# EAGLE design syringe board 1.6 (EAGLE 7.7.0)
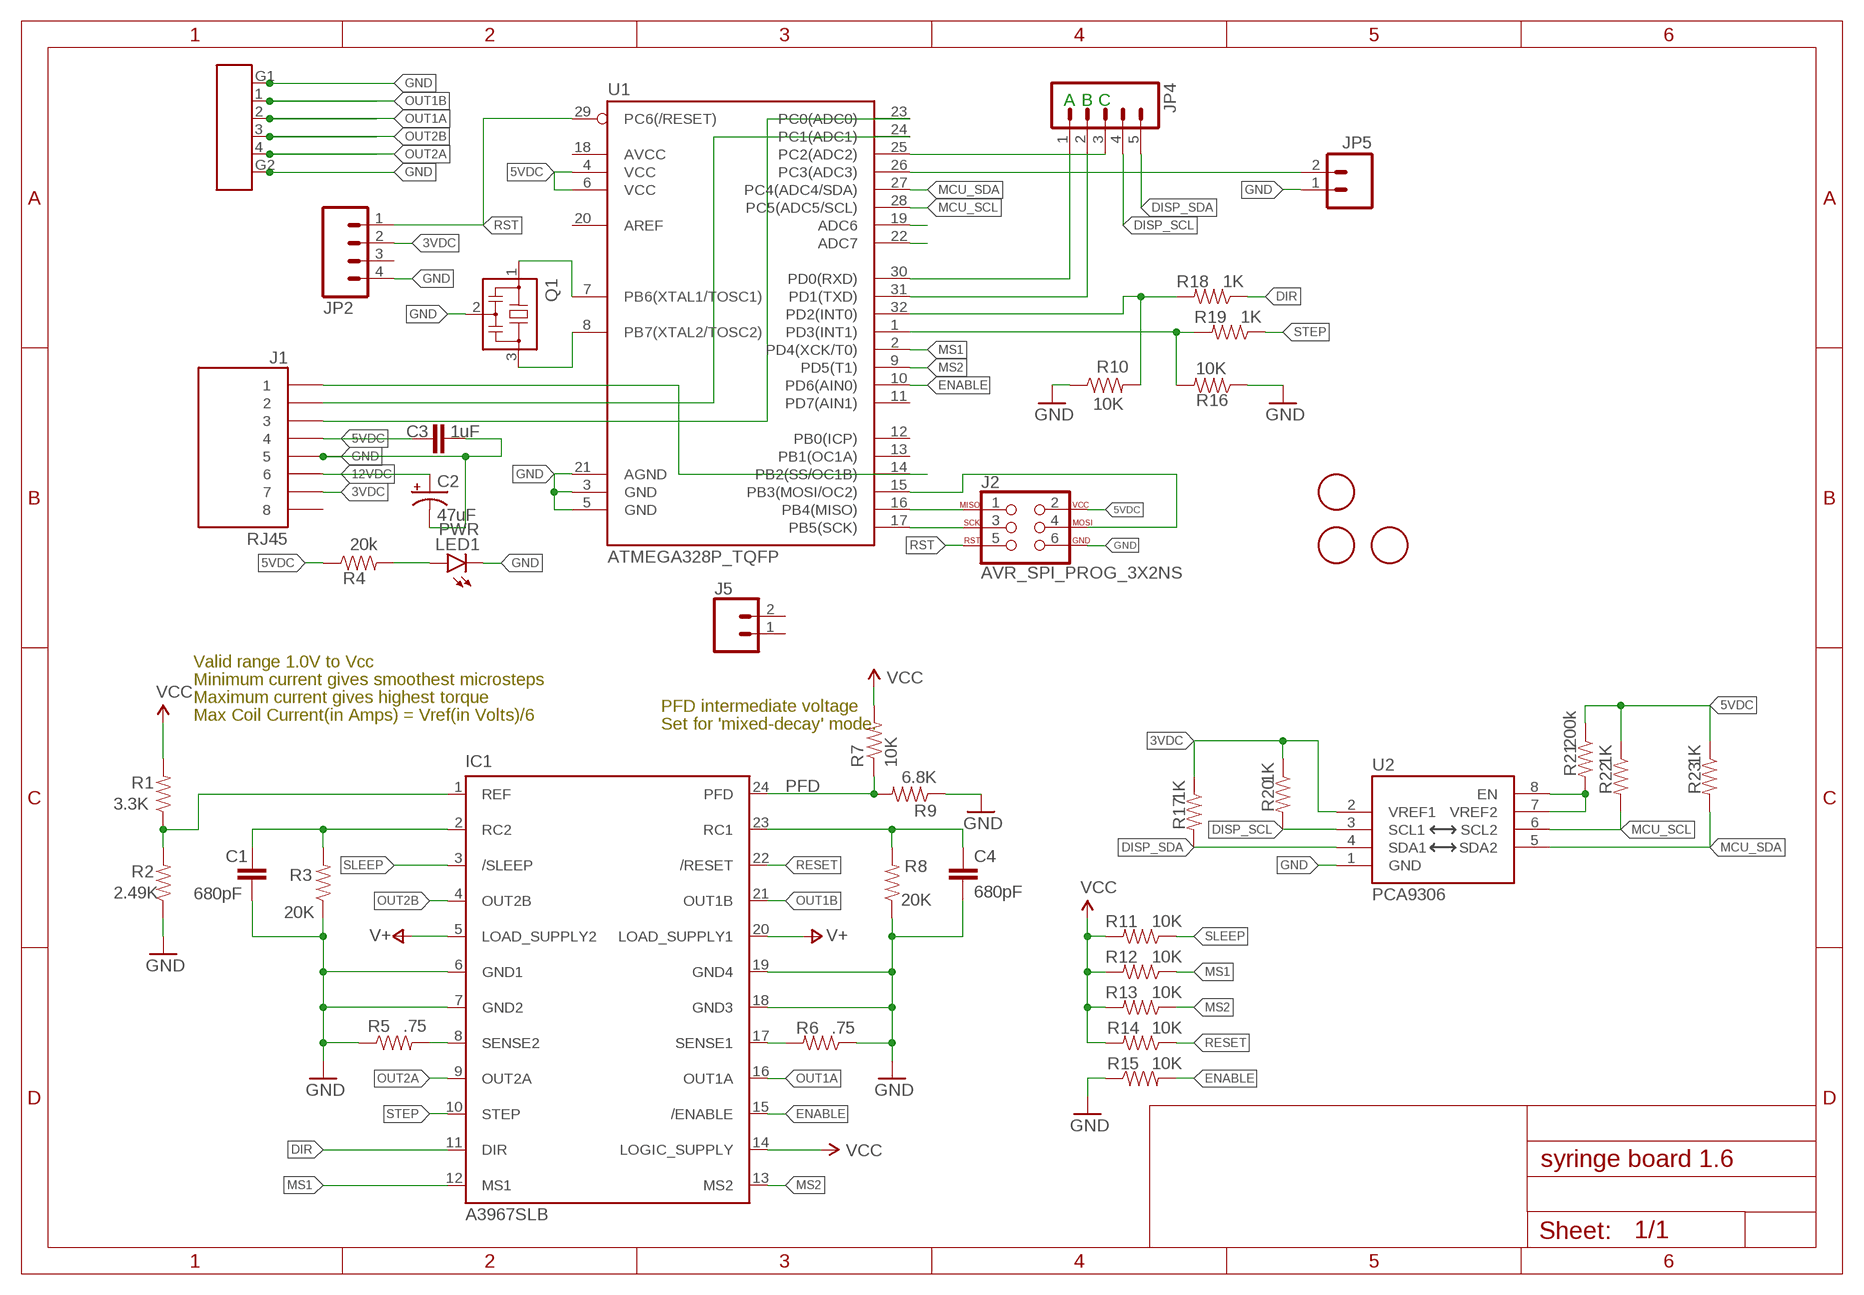
[diagram p0: schematic, sheet 1]

## Parts
C1  680pF  CAP0603-CAP  [0603-CAP]
C2  47uF  CPOL-USD  [PANASONIC_D]
C3  1uF  CAP0603-CAP  [0603-CAP]
C4  680pF  CAP0603-CAP  [0603-CAP]
IC1  A3967SLB  [SO24W]
J1  RJ45  [RJ45-8]
J2  AVR_SPI_PROG_3X2NS  [2X3-NS]
J5  CONN_021X02_NO_SILK  [1X02_NO_SILK]
JP2  M04NO_SILK_ALL_ROUND  [1X04_NO_SILK_ALL_ROUND]
JP4  M05NO_SILK  [1X05_NO_SILK]
JP5  M021X02_NO_SILK  [1X02_NO_SILK@1]
LED1  PWR  LED0603  [LED-0603]
Q1  RESONATOR_CSTCE_V  [CSTCE_V]
R1  3.3K  RESISTOR0603  [0603-RES]
R2  2.49K  RESISTOR0603  [0603-RES]
R3  20K  RESISTOR0603  [0603-RES]
R4  20k  RESISTOR0603  [0603-RES]
R5  .75  RESISTOR0805-RES  [0805]
R6  .75  RESISTOR0805-RES  [0805]
R7  10K  RESISTOR0603  [0603-RES]
R8  20K  RESISTOR0603  [0603-RES]
R9  6.8K  RESISTOR0603  [0603-RES]
R10  10K  RESISTOR0603  [0603-RES]
R11  10K  RESISTOR0603  [0603-RES]
R12  10K  RESISTOR0603  [0603-RES]
R13  10K  RESISTOR0603  [0603-RES]
R14  10K  RESISTOR0603  [0603-RES]
R15  10K  RESISTOR0603  [0603-RES]
R16  10K  RESISTOR0603  [0603-RES]
R17  1K  RESISTOR0603  [0603-RES]
R18  1K  RESISTOR0603  [0603-RES]
R19  1K  RESISTOR0603  [0603-RES]
R20  1K  RESISTOR0603  [0603-RES]
R21  200k  RESISTOR0603  [0603-RES]
R22  1K  RESISTOR0603  [0603-RES]
R23  1K  RESISTOR0603  [0603-RES]
U1  ATMEGA328P_TQFP  [TQFP32-08]
U2  PCA9306  [PSOP-8]
U$1  FIDUCIAL  [FIDUCIAL_1MM]
U$2  FIDUCIAL  [FIDUCIAL_1MM]
U$3  FIDUCIAL  [FIDUCIAL_1MM]
U$5  OMRON_4PIN  [OMRON_4PIN]

## Nets
3VDC: J1.7 JP2.2 R17.1 R20.1 U2.2(VREF1)
5VDC: C3.1 IC1.14(LOGIC_SUPPLY) J1.4 J2.2 R1.2 R4.1 R7.2 R11.2 R12.2 R13.2 R14.2 R21.1 R22.1 R23.1 U1.4(VCC) U1.6(VCC) ; supply symbol labelled VCC
12VDC: C2.+ IC1.5(LOAD_SUPPLY2) IC1.20(LOAD_SUPPLY1) J1.6 ; supply symbol labelled V+
DIR: IC1.11(DIR) R18.1
DIR_IN: R10.2 R18.2 U1.32(PD2(INT0))
DISP_SCL: JP4.4 R20.2 U2.3(SCL1)
DISP_SDA: JP4.5 R17.2 U2.4(SDA1)
ENABLE: IC1.15(/ENABLE) R15.2 U1.10(PD6(AIN0))
GND: C1.2 C2.- C3.2 C4.2 IC1.6(GND1) IC1.7(GND2) IC1.18(GND3) IC1.19(GND4) J1.5 J2.6 JP2.4 JP5.1 LED1.C Q1.2 R2.1 R3.1 R5.1 R6.1 R8.1 R9.1 R10.1 R15.1 R16.1 U1.3(GND) U1.5(GND) U1.21(AGND) U2.1(GND) U$5.G1(GND1) U$5.G2(GND2)
MCU_SCL: R22.2 U1.28(PC5(ADC5/SCL)) U2.6(SCL2)
MCU_SDA: R23.2 U1.27(PC4(ADC4/SDA)) U2.5(SDA2)
MS1: IC1.12(MS1) R12.1 U1.2(PD4(XCK/T0))
MS2: IC1.13(MS2) R13.1 U1.9(PD5(T1))
N$1: IC1.8(SENSE2) R5.2
N$2: Q1.1 U1.7(PB6(XTAL1/TOSC1))
N$3: IC1.17(SENSE1) R6.2
N$4: Q1.3 U1.8(PB7(XTAL2/TOSC2))
N$5: C1.1 IC1.2(RC2) R3.2
N$6: R21.2 U2.7(VREF2) U2.8(EN)
N$7: C4.1 IC1.23(RC1) R8.2
N$8: LED1.A R4.2
N$9: J2.1 U1.16(PB4(MISO))
N$10: J2.3 U1.17(PB5(SCK))
N$11: J2.4 U1.15(PB3(MOSI/OC2))
N$12: J1.3 U1.23(PC0(ADC0))
N$14: U1.22(ADC7)
N$15: JP4.1 U1.30(PD0(RXD))
N$16: JP4.2 U1.31(PD1(TXD))
N$17: JP4.3 U1.25(PC2(ADC2))
N$18: U1.19(ADC6)
N$19: JP5.2 U1.26(PC3(ADC3))
N$20: J1.2 U1.24(PC1(ADC1))
N$21: J1.1 U1.14(PB2(SS/OC1B))
OUT1A: IC1.16(OUT1A) U$5.2
OUT1B: IC1.21(OUT1B) U$5.1
OUT2A: IC1.9(OUT2A) U$5.4
OUT2B: IC1.4(OUT2B) U$5.3
PFD: IC1.24(PFD) R7.1 R9.2
RESET: IC1.22(/RESET) R14.1
RST: J2.5 JP2.1 U1.29(PC6(/RESET))
SLEEP: IC1.3(/SLEEP) R11.1
STEP: IC1.10(STEP) R19.1
STEP_IN: R16.2 R19.2 U1.1(PD3(INT1))
VREF: IC1.1(REF) R1.1 R2.2
Unconnected: J1.8 J5.1 J5.2 JP2.3 U1.11(PD7(AIN1)) U1.12(PB0(ICP)) U1.13(PB1(OC1A)) U1.18(AVCC) U1.20(AREF)

## Notes on the sheet
- A | B | C
- Valid range 1.0V to Vcc
- Minimum current gives smoothest microsteps
- Maximum current gives highest torque
- PFD intermediate voltage
- Max Coil Current(in Amps) = Vref(in Volts)/6
- Set for 'mixed-decay' mode.

## Library data of the parts
C1 C3 C4 = SparkFun-Capacitors:CAP: Capacitor Standard 0603 ceramic capacitor, and 0.1" leaded capacitor.
C2 = adafruit:CPOL-US: POLARIZED CAPACITOR, American symbol
IC1 = Allegro:A3967SLB: ANALOG DEVICES
J1 = Andy-library:RJ45
J2 = SparkFun-Connectors:AVR_SPI_PROG_3X2: AVR ISP 6 Pin This is the reduced ISP connector for AVR programming. Common on Arduino. This footprint will take up less PCB space and can be used with a 10-pin to 6-pin adapter such as SKU: BOB-08508 **Special note about "TEST_POINT" package. The stop mask is on the top side, so if you want your programming test points to be on the bottom of your board, make sure to place this package on the bottom side of the board. This also ensure that the orientation to program from the bottom side will be correct. SparkFun Products: SparkFun ISP Pogo Adapter <https://www.sparkfun.com/products/11591> - NS Tiny AVR Programmer <https://www.sparkfun.com/products/11801> -PTH
J5 = SparkFun-Connectors:CONN_02: Multi connection point. Often used as Generic Header-pin footprint for 0.1 inch spaced/style header connections On any of the 0.1 inch spaced packages, you can populate with these: Break Away Headers - Straight <https://www.sparkfun.com/products/116> (PRT-00116) Break Away Male Headers - Right Angle <https://www.sparkfun.com/products/553> (PRT-00553) Female Headers <https://www.sparkfun.com/products/115> (PRT-00115) Break Away Headers - Machine Pin <https://www.sparkfun.com/products/117> (PRT-00117) Break Away Female Headers - Swiss Machine Pin <https://www.sparkfun.com/products/743> (PRT-00743) For SCREWTERMINALS and SPRING TERMINALS visit here: Screw Terimnals on SparkFun.com <https://www.sparkfun.com/search/results?term=Screw+Terminals> (5mm/3.5mm/2.54mm spacing) This device is also useful as a general connection point to wire up your design to another part of your project. Our various solder wires solder well into these plated through hole pads. Hook-Up Wire - Assortment (Stranded, 22 AWG) <https://www.sparkfun.com/products/11375> (PRT-11375) Hook-Up Wire - Assortment (Solid Core, 22 AWG) <https://www.sparkfun.com/products/11367> (PRT-11367) View the entire wire category on our website here <https://www.sparkfun.com/categories/141> Special notes: Molex polarized connector foot print use with: PRT-08233 with associated crimp pins and housings. 2.54_SCREWTERM for use with PRT-10571. 3.5mm Screw Terminal footprints for PRT-08084 5mm Screw Terminal footprints for use with PRT-08432
JP2 = SparkFun-Connectors:M04: Header 4 Standard 4-pin 0.1" header. Use with straight break away headers (SKU : PRT-00116), right angle break away headers (PRT-00553), swiss pins (PRT-00743), machine pins (PRT-00117), and female headers (PRT-00115). Molex polarized connector foot print use with SKU : PRT-08231 with associated crimp pins and housings. 1MM SMD Version SKU: PRT-10208
JP4 = SparkFun-Connectors:M05: Header 5 Standard 5-pin 0.1" header. Use with straight break away headers (SKU : PRT-00116), right angle break away headers (PRT-00553), swiss pins (PRT-00743), machine pins (PRT-00117), and female headers (PRT-00115). Molex polarized connector foot print use with SKU : PRT-08230 with associated crimp pins and housings.
JP5 = SparkFun-Connectors:M02: Standard 2-pin 0.1" header. Use with - straight break away headers ( PRT-00116) - right angle break away headers (PRT-00553) - swiss pins (PRT-00743) - machine pins (PRT-00117) - female headers (PRT-00115) Molex polarized connector foot print use with: PRT-08233 with associated crimp pins and housings. 2.54_SCREWTERM for use with PRT-10571. 3.5mm Screw Terminal footprints for PRT-08084 5mm Screw Terminal footprints for use with PRT-08432
LED1 = Andy-library:LED: LEDs Standard schematic elements and footprints for 5mm, 3mm, 1206, and 0603 sized LEDs. 5mm - Spark Fun Electronics SKU : COM-00529 (and others)
Q1 = Andy-library:RESONATOR: 16 MHz Resonator(Murata p/n CSTCE16M0V53-R0) Digikey: 490-1198-1-ND <http://www.digikey.com/product-search/en?keywords=490-1198-1-nd>
R1-R23 = SparkFun-Resistors:RESISTOR: Resistor Basic schematic elements and footprints for 0603, 1206, and PTH resistors.
U1 = SparkFun-DigitalIC:ATMEGA328P_TQFP; PROD_ID: IC-09069
U2 = SparkFun-DigitalIC:PCA9306: Bidirectional I2C level shifter. NOT compatible with all available part number pinout schemes- DOUBLE CHECK!!!; PROD_ID: IC-10023
U$1-U$3 = adafruit:FIDUCIAL: For use by pick and place machines to calibrate the vision/machine, 1mm By microbuilder.eu
U$5 = Andy-library:OMRON_4PIN: Omron 4 pin connector XN2D-1471 Digikey OR1027-ND <https://www.digikey.com/products/en/connectors-interconnects/rectangular-connectors-headers-receptacles-female-sockets/315?k=OR1027-ND> mates with Omron XN2A-1470 Digikey OR1021-ND <https://www.digikey.com/product-detail/en/omron-electronics-inc-emc-div/XN2A-1470/OR1021-ND/2330559>

## Board
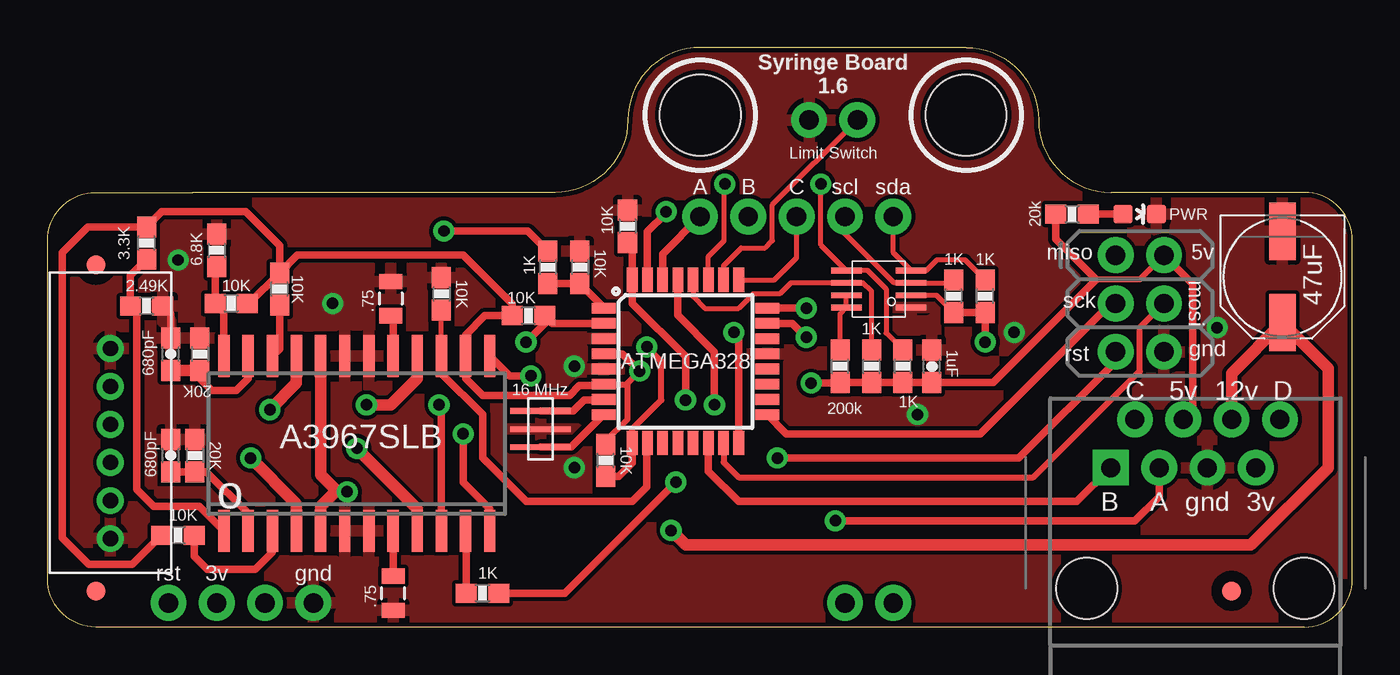
[diagram p1: board, top side]
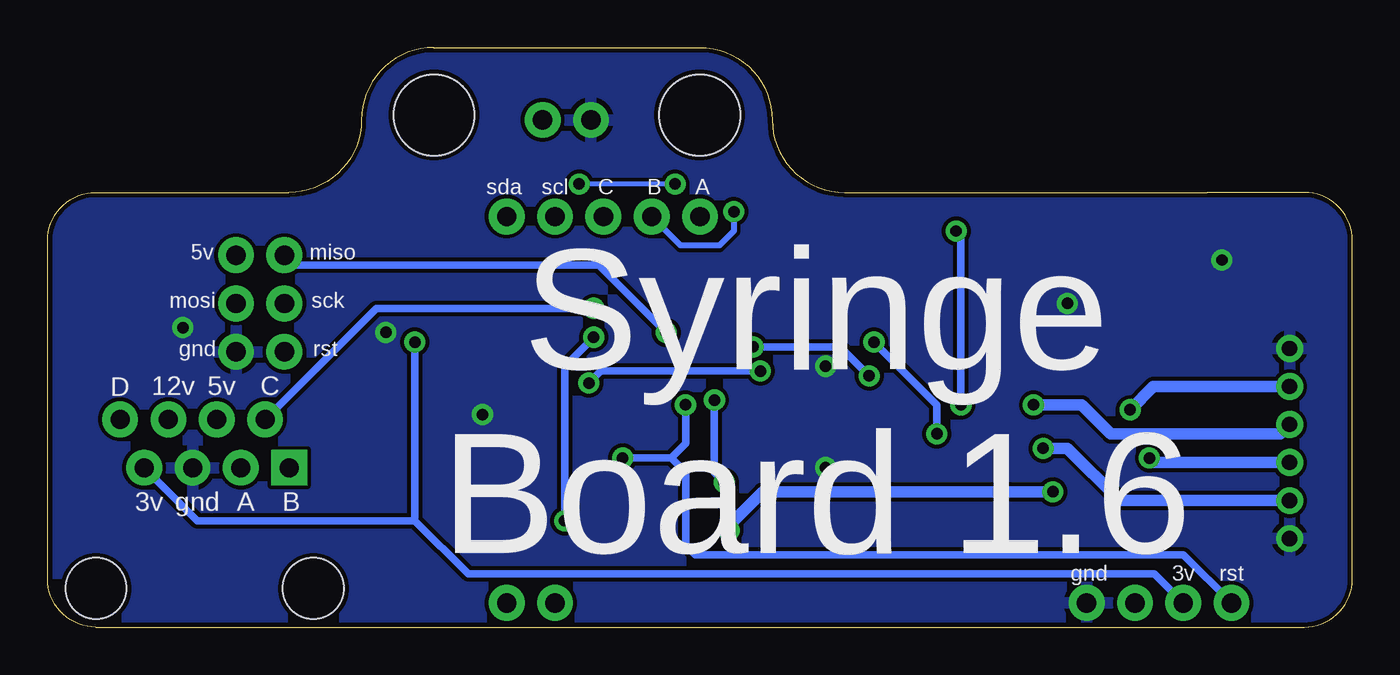
[diagram p2: board, bottom side, seen from below]

Size 68.58 x 30.48 mm. Coordinates in mm from the lower left corner, seen from the top.
Outline: 7.64,22.86 26.68,22.86 arc90 30.5,26.67 arc-90 34.3,30.48 48.27,30.48 arc-90 52.09,26.67 arc90 55.9,22.86 66.04,22.86 arc-90 68.58,20.32 68.58,2.54 arc-90 66.04,0 2.54,0 arc-90 0,2.54 0,20.32 arc-90 2.54,22.86 7.62,22.86
Copper layers (1*16): Top 0.035mm / dielectric 1.5mm / Bottom 0.035mm
Design rules "GoldPhoenix_8and8 *": minimum track width 7mil, minimum drill 15mil, track to track 8mil, track to pad 8mil, pad to pad 8mil, via to via 8mil, smd to smd 8mil, copper to edge 10mil, drill to drill 8mil, minimum pad ring 12mil, minimum via ring 10mil, stop-mask expansion 4mil, vias tented up to drill 25mil, thermal gap 10mil
Holes 4.25 mm at 34.3,26.92 48.27,26.92

### Footprints (pad centres in the part's own frame; a part is rotated, then mirrored left to right if it is on the bottom)
0603-CAP = smd 1.1 x 1: 1 -0.85,0; 2 0.85,0
PANASONIC_D = smd 3 x 1.4: + 2.4,0; - -2.4,0
SO24W = smd 0.6 x 2.2: 1 -6.985,-4.6; 2 -5.715,-4.6; 3 -4.445,-4.6; 4 -3.175,-4.6; 5 -1.905,-4.6; 6 -0.635,-4.6; 7 0.635,-4.6; 8 1.905,-4.6; 9 3.175,-4.6; 10 4.445,-4.6; 11 5.715,-4.6; 12 6.985,-4.6; 13 6.985,4.6; 14 5.715,4.6; 15 4.445,4.6; 16 3.175,4.6; 17 1.905,4.6; 18 0.635,4.6; 19 -0.635,4.6; 20 -1.905,4.6; 21 -3.175,4.6; 22 -4.445,4.6; 23 -5.715,4.6; 24 -6.985,4.6
RJ45-8 = drill 1 pad 1.88 square: 1 -4.445,6.35 | drill 1 pad 1.88: 2 -3.175,8.89; 3 -1.905,6.35; 4 -0.635,8.89; 5 0.635,6.35; 6 1.905,8.89; 7 3.175,6.35; 8 4.445,8.89 | hole 3.2: -5.715,0; 5.715,0
2X3-NS = drill 1.016 pad 1.88: 1 -2.54,-1.27; 2 -2.54,1.27; 3 0,-1.27; 4 0,1.27; 5 2.54,-1.27; 6 2.54,1.27
1X02_NO_SILK = drill 1.016 pad 1.88: 1 0,0; 2 2.54,0
1X04_NO_SILK_ALL_ROUND = drill 1.016 pad 1.88: 1 0,0; 2 2.54,0; 3 5.08,0; 4 7.62,0
1X05_NO_SILK = drill 1.016 pad 1.88: 1 0,0; 2 2.54,0; 3 5.08,0; 4 7.62,0; 5 10.16,0
1X02_NO_SILK@1 = drill 1.016 pad 1.88: 1 0,0; 2 2.54,0
LED-0603 = smd 1 x 1: A 0,-0.877; C 0,0.877
CSTCE_V = smd 0.3 x 3.175: 1 -0.95,0; 2 0,0; 3 0.95,0
0603-RES = smd 1.1 x 1: 1 -0.85,0; 2 0.85,0
0805 = smd 0.8 x 1.2: 1 -0.9,0; 2 0.9,0
TQFP32-08 = smd 1.27 x 0.559: 1 -4.293,2.8; 2 -4.293,2; 3 -4.293,1.2; 4 -4.293,0.4; 5 -4.293,-0.4; 6 -4.293,-1.2; 7 -4.293,-2; 8 -4.293,-2.8; 17 4.293,-2.8; 18 4.293,-2; 19 4.293,-1.2; 20 4.293,-0.4; 21 4.293,0.4; 22 4.293,1.2; 23 4.293,2; 24 4.293,2.8 | smd 0.559 x 1.27: 9 -2.8,-4.293; 10 -2,-4.293; 11 -1.2,-4.293; 12 -0.4,-4.293; 13 0.4,-4.293; 14 1.2,-4.293; 15 2,-4.293; 16 2.8,-4.293; 25 2.8,4.293; 26 2,4.293; 27 1.2,4.293; 28 0.4,4.293; 29 -0.4,4.293; 30 -1.2,4.293; 31 -2,4.293; 32 -2.8,4.293
PSOP-8 = smd 0.3 x 1.6: 1 -0.975,-1.7; 2 -0.325,-1.7; 3 0.325,-1.7; 4 0.975,-1.7; 5 0.975,1.7; 6 0.325,1.7; 7 -0.325,1.7; 8 -0.975,1.7
FIDUCIAL_1MM = smd 1 x 1: 1 0,0
OMRON_4PIN = drill 0.8: 1 -3,0; 2 -1,0; 3 1,0; 4 3,0; G1 -5,0; G2 5,0

### Placement (x,y rotation side)
C1  6.48,9.02 90 top
C2  64.9,18.41 270 top
C3  46.48,13.72 90 top
C4  6.48,14.35 90 top
IC1  16.26,9.65 0 top
J1  60.33,2.03 0 top
J2  57.4,17.02 270 top
J5  41.91,1.27 0 top
JP2  6.35,1.27 0 top
JP4  34.29,21.59 0 top
JP5  40.02,26.67 0 top
LED1  57.4,21.72 270 top
Q1  25.91,10.41 270 top
R1  5.21,20.19 90 top
R2  5.21,16.89 180 top
R3  7.75,9.02 270 top
R4  53.85,21.72 0 top
R5  18.16,1.78 90 top
R6  18.03,17.27 270 top
R7  9.65,17.02 0 top
R8  8,14.35 270 top
R9  8.89,19.81 270 top
R10  30.48,21.08 270 top
R11  6.86,4.83 180 top
R12  25.27,16.38 180 top
R13  29.34,8.76 90 top
R14  12.19,17.78 90 top
R15  20.7,17.53 270 top
R16  27.98,18.93 270 top
R17  49.28,17.4 90 top
R18  22.86,1.78 0 top
R19  26.29,18.92 270 top
R20  47.62,17.4 90 top
R21  41.66,13.72 90 top
R22  43.31,13.72 90 top
R23  44.96,13.72 90 top
U1  33.53,13.97 0 top
U2  43.69,17.78 90 top
U$1  2.54,19.05 0 top
U$2  2.54,1.91 0 top
U$3  62.23,1.91 0 top
U$5  3.3,9.65 270 top

### Tracks (layer width: path | path; a pad name or v marks a point on that pad's centre or on a via)
3VDC  (via drill 0.6)
  Top 0.254: U2.2 46.72,17.45 R20.1
  Top 0.406: R20.1 R17.1 v49.28,14.99
  Bottom 0.406: JP2.2 10.41,2.79 46.48,2.79 49.28,5.59 | v49.28,14.99 49.28,5.59 | 49.28,5.59 60.71,5.59 J1.7
5VDC  (via drill 0.6)
  Top 0.305: J2.2 57.4,18.29 55.12,18.29 | 29.34,9.78 30.48,10.92 30.48,12.71 30.42,12.77 | U1.6 30.42,12.77 | 30.42,12.77 v31.11,13.46
  Top 0.406: U1.4 30.21,14.37 v31.11,13.46 | v40.13,12.83 41.62,12.83 R21.1 R22.1 R23.1 C3.1 49.7,12.87 55.12,18.29 53,20.41 R4.1 | R14.2 12.19,20.07 10.41,21.84 6.01,21.84 R1.2 2.12,21.04 0.76,19.68 0.76,4.7 2.16,3.3 4.45,3.3 5.97,4.83 R11.2 | R7.2 10.58,17.02 R14.2 | U1.6 29.16,12.7 27.94,12.7 27.43,12.19 22.86,12.19 21.97,13.08 IC1.14 21.97,15.37 22.99,16.38 R12.2 24.42,16.98 21.84,19.56 13.12,19.56 R14.2 | 29.34,9.78 R13.2 | J1.4 60.2,11.43 60.2,18.03 J2.2
  Bottom 0.406: v31.11,13.46 39.5,13.46 v40.13,12.83
12VDC  (via drill 0.6)
  Top 0.61: IC1.5 14.35,6.35 15.11,7.11 15.24,7.11 | v15.75,7.11 15.24,7.11 | J1.6 62.23,13.35 C2.+ 67.31,13.6 67.31,8.38 63.25,4.32 33.53,4.32 v32.77,5.08 | IC1.20 14.35,8 15.24,7.11
  Bottom 0.61: v15.75,7.11 30.99,7.11 32.77,5.33 v32.77,5.08
DIR
  Top 0.406: R18.1 22.01,5.01 IC1.11
DIR_IN  (via drill 0.6)
  Top 0.406: R10.2 30.73,19.98 U1.32 30.73,17.02 33.53,14.22 v33.53,11.94 | R18.2 27.18,1.78 v33.02,7.62
  Bottom 0.406: v33.02,7.62 33.53,8.13 v33.53,11.94
DISP_SCL
  Top 0.254: JP4.4 41.91,20.7 44.51,18.11 U2.3 47.62,18.11 R20.2
DISP_SDA
  Top 0.254: JP4.5 44.45,19.69 U2.4 46.19,18.75 46.74,19.3 48.22,19.3 R17.2
ENABLE
  Top 0.254: IC1.15 R15.2
  Top 0.406: IC1.15 20.7,13.34 22.86,11.18 22.86,8.89 25.15,6.6 30.73,6.6 31.5,7.37 31.5,9.64 U1.10
GND  (via drill 0.6)
  Top 0.254: IC1.19 15.62,14.85
  Top 0.406: R2.1 6.48,16.47 C4.2
  other vias: 14.99,17.02 6.86,19.3 27.69,8.38 27.69,13.72 45.72,11.18 50.8,15.49 61.47,15.75
  pour Bottom: 0,32 68.71,31.88 68.58,0 0,0
  pour Top: -0.02,31.94 68.69,31.81 68.58,0 0,0
MCU_SCL
  Top 0.254: U1.28 33.93,17.38 34.54,16.76 36.32,16.76 37.08,17.53 38.48,17.53 39.06,18.11 U2.6 42.85,18.11 43.31,17.65 R22.2
MCU_SDA  (via drill 0.6)
  Top 0.254: U1.27 34.73,19.49 35.56,20.32 35.56,23.26 v35.6,23.3 | R23.2 44.07,15.46 44.07,17.78 43.09,18.75 U2.5 40.64,20.1 v40.64,23.3
  Bottom 0.254: v35.6,23.3 v40.64,23.3
MS1  (via drill 0.6)
  Top 0.406: U1.2 26.54,15.97 R12.1 26.12,15.96 v25.15,14.99 | IC1.12 23.24,6.22 21.84,7.62 v21.84,10.16
  Bottom 0.406: v21.84,10.16 21.84,11.68 v25.15,14.99
MS2  (via drill 0.6)
  Top 0.305: U1.9 30.73,10.41 32.26,11.94 32.26,13.97 v31.5,14.73
  Top 0.406: R13.1 30.01,7.91 30.73,8.63 U1.9 | v25.4,13.21 24.29,13.21 IC1.13
  Bottom 0.406: v31.5,14.73 26.92,14.73 v25.4,13.21
N$1
  Top 0.406: IC1.8 R5.2
N$2
  Top 0.406: Q1.1 27.62,11.36 28.19,11.94 29.2,11.94 U1.7
N$3
  Top 0.406: IC1.17 18.16,16.25 R6.2
N$4
  Top 0.406: Q1.3 27.53,9.46 U1.8
N$5
  Top 0.406: C1.1 R3.2 8.34,8.17 10.54,5.97 IC1.2
N$6
  Top 0.254: U2.7 U2.8 41.66,16.47 R21.2
N$7
  Top 0.406: R8.2 8,13.08 8.64,12.45 9.91,12.45 10.54,13.08 IC1.23
  Top 0.61: C4.1 R8.2
N$8
  Top 0.406: R4.2 LED1.A
N$9  (via drill 0.6)
  Top 0.406: U1.16 36.33,15.23 v36.07,15.49
  Bottom 0.406: v36.07,15.49 39.62,19.05 55.63,19.05 J2.1
N$10
  Top 0.406: J2.3 55.88,17.02 49.02,10.16 38.83,10.16 U1.17
N$11
  Top 0.305: U1.15 35.53,8.67 36.32,7.87 51.82,7.87 57.4,13.46 57.4,15.75 J2.4
N$12  (via drill 0.6)
  Top 0.406: U1.23 39.15,15.97 v39.88,15.24 | v41.4,5.59 57.15,5.59 58.42,6.86 J1.3
  Bottom 0.406: v39.88,15.24 41.4,13.72 v41.4,5.59
N$15
  Top 0.406: U1.30 32.33,19.63 JP4.1
N$16  (via drill 0.6)
  Top 0.406: U1.31 31.53,20.8 32.51,21.78 v32.51,21.84
  Bottom 0.305: v32.51,21.84 32.51,20.83 33.27,20.07 35.31,20.07 JP4.2
N$17
  Top 0.254: U1.25 38.2,18.26 39.37,19.43 JP4.3
N$19
  Top 0.254: U1.26 35.53,19.02 36.45,19.94 37.72,19.94 38.1,20.32 38.1,22.21 JP5.2
N$20  (via drill 0.6)
  Top 0.406: U1.24 v39.87,16.77 v39.88,16.76
  Bottom 0.406: v39.88,16.76 51.31,16.76 J1.2
N$21
  Top 0.406: U1.14 34.73,8.2 36.32,6.6 54.1,6.6 J1.1
OUT1A  (via drill 0.6)
  Top 0.61: IC1.16 19.43,13.08 18.03,11.68 v16.76,11.68
  Bottom 0.61: v16.76,11.68 14.22,11.68 12.7,10.16 3.79,10.16 U$5.2
OUT1B  (via drill 0.6)
  Top 0.61: v11.68,11.43 13.08,12.83 IC1.21
  Bottom 0.61: v11.68,11.43 10.46,12.65 U$5.1
OUT2A  (via drill 0.6)
  Top 0.61: v16.26,9.4 19.43,6.22 IC1.9
  Bottom 0.61: v16.26,9.4 14.99,9.4 12.24,6.65 U$5.4
OUT2B  (via drill 0.6)
  Top 0.61: IC1.4 13.08,6.48 v10.67,8.89
  Bottom 0.61: v10.67,8.89 10.43,8.65 U$5.3
PFD
  Top 0.406: IC1.24 9.27,16.55 R7.1 8.8,18.87 R9.2
RESET
  Top 0.406: IC1.22 12.19,14.63 R14.1
RST  (via drill 0.6)
  Top 0.406: U1.29 33.13,16.4 35.05,14.48 v35.05,11.68 | v38.35,8.89 51.05,8.89 56.13,13.97 J2.5
  Bottom 0.406: JP2.1 8.89,3.81 34.54,3.81 35.05,4.32 35.05,8.13 35.81,8.89 | v35.05,11.68 35.05,9.65 35.81,8.89 | v38.35,8.89 35.81,8.89
SLEEP
  Top 0.406: IC1.3 11.81,3.94 10.92,3.05 8.38,3.05 7.71,3.72 R11.1
STEP  (via drill 0.6)
  Top 0.406: R19.1 25.23,20.83 v20.83,20.83 | v20.57,11.68 20.7,11.56 IC1.10
  Bottom 0.406: v20.83,20.83 20.57,20.57 v20.57,11.68
STEP_IN
  Top 0.406: U1.1 29.23,16.82 R16.2 R19.2
VREF
  Top 0.406: IC1.1 7.97,6.35 5.59,6.35 4.7,7.24 4.7,16.55 R2.2 | 4.32,16.85 R2.2 | R2.2 4.36,18.49 R1.1

### Text on the board
tNames: Syringe Board / 1.6 | Limit Switch | A | B | C | scl | sda | miso | 5v | sck | mosi | ATMEGA328 | rst | gnd | 16 MHz | C | 5v | 12v | D | o | B | A | gnd | 3v | rst | 3v | gnd
bNames: A | B | C | scl | sda | miso | 5v | sck | mosi | rst | gnd | Syringe / Board 1.6 | C | 5v | 12v | D | B | A | gnd | 3v | rst | 3v | gnd